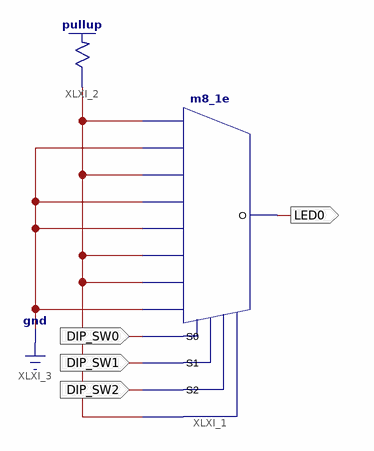
[diagram p0: schematic sheet 1]
// Xilinx ISE schematic lab4_mux3.sch (spartan3) as structural Verilog: 2 symbols, 4 ports
module lab4_mux3 (
  input  DIP_SW0,
  input  DIP_SW1,
  input  DIP_SW2,
  output LED0
);

  wire XLXN_1;

  m8_1e XLXI_1 (
    .D0(XLXN_1), .D1(1'b0), .D2(XLXN_1), .D3(1'b0), .D4(1'b0), .D5(XLXN_1), .D6(XLXN_1), .D7(1'b0),
    .E(XLXN_1), .S0(DIP_SW0), .S1(DIP_SW1), .S2(DIP_SW2), .O(LED0));
  \pullup  XLXI_2 (.O(XLXN_1));
endmodule
